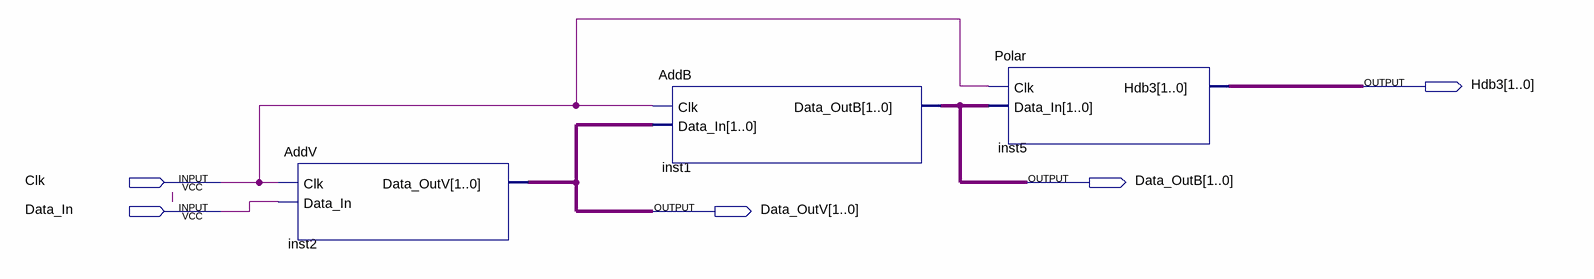
[diagram p0: schematic sheet]
// Quartus schematic Hdb3.bdf as structural Verilog: 3 symbols, 5 pins
module Hdb3 (
  input  Clk,
  input  Data_In,
  output [1:0] Hdb3,
  output [1:0] Data_OutB,
  output [1:0] Data_OutV
);

  AddV inst2 (.Clk(Clk), .Data_In(Data_In), .Data_OutV(Data_OutV));
  AddB inst1 (.Clk(Clk), .Data_In(Data_OutV), .Data_OutB(Data_OutB));
  Polar inst5 (.Clk(Clk), .Data_In(Data_OutB), .Hdb3(Hdb3));
endmodule
